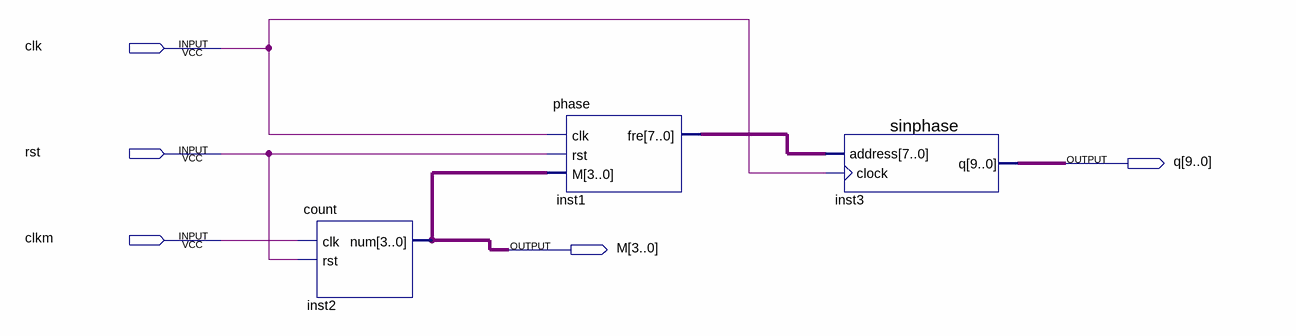
[diagram p0: schematic sheet]
// Quartus schematic demo.bdf as structural Verilog: 3 symbols, 5 pins
module demo (
  input  clk,
  input  rst,
  input  clkm,
  output [9:0] q,
  output [3:0] M
);

  wire [7:0] inst1_fre;

  count inst2 (.clk(clkm), .rst(rst), .num(M));
  phase inst1 (.clk(clk), .rst(rst), .M(M), .fre(inst1_fre));
  sinphase inst3 (.address(inst1_fre), .clock(clk), .q(q));
endmodule
